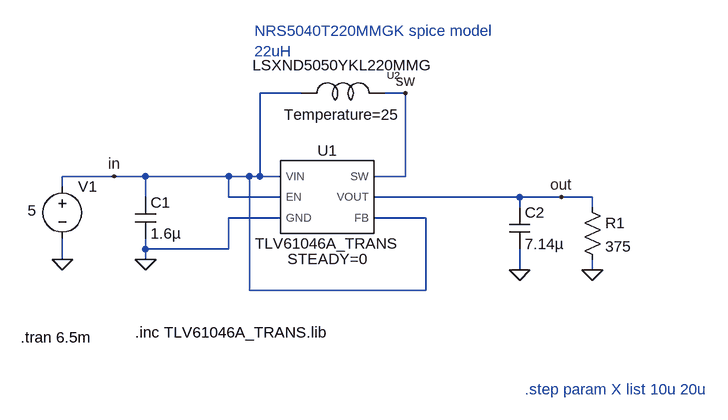
[diagram p0: schematic boost_TLV61046A.asc]
boost_TLV61046A.asc, the LTspice schematic file:
Version 4
SHEET 1 1272 680
WIRE 304 96 240 96
WIRE 464 96 432 96
WIRE 16 224 -64 224
WIRE 64 224 16 224
WIRE 192 224 64 224
WIRE 224 224 192 224
WIRE 240 224 240 96
WIRE 240 224 224 224
WIRE 272 224 240 224
WIRE 464 224 464 96
WIRE 464 224 416 224
WIRE -64 240 -64 224
WIRE 64 256 64 224
WIRE 192 256 192 224
WIRE 272 256 192 256
WIRE 640 256 416 256
WIRE 704 256 640 256
WIRE 752 256 704 256
WIRE 640 272 640 256
WIRE 752 272 752 256
WIRE 272 288 192 288
WIRE 496 288 416 288
WIRE 64 336 64 320
WIRE 192 336 192 288
WIRE 192 336 64 336
WIRE -64 352 -64 320
WIRE 64 352 64 336
WIRE 640 368 640 336
WIRE 752 368 752 352
WIRE 224 400 224 224
WIRE 496 400 496 288
WIRE 496 400 224 400
FLAG 640 368 0
FLAG 64 352 0
FLAG 752 368 0
FLAG -64 352 0
FLAG 704 256 out
FLAG 16 224 in
FLAG 464 96 sw
SYMBOL Cap 48 256 R0
SYMATTR InstName C1
SYMATTR Value 1.6µ
SYMBOL Cap 624 272 R0
SYMATTR InstName C2
SYMATTR Value 7.14µ
SYMBOL Res 736 256 R0
SYMATTR InstName R1
SYMATTR Value 375
SYMBOL Voltage -64 224 R0
WINDOW 3 -53 53 Left 2
SYMATTR Value 5
SYMATTR InstName V1
SYMATTR SpiceLine Rser=1m
SYMBOL LSXND5050YKL220MMG 368 96 R0
WINDOW 38 0 -43 Center 2
SYMATTR InstName U2
SYMBOL TLV61046A_TRANS 336 256 R0
SYMATTR InstName U1
TEXT -128 472 Left 2 !.tran 6.5m
TEXT 648 552 Left 2 ;.step param X list 10u 20u
TEXT 48 464 Left 2 !.inc TLV61046A_TRANS.lib
TEXT 232 0 Left 2 ;NRS5040T220MMGK spice model\n22uH

The netlist it stands for:
* boost_TLV61046A.asc
C1 in 0 1.6µ
C2 out 0 7.14µ
R1 out 0 375
V1 in 0 5 Rser=1m
XU2 in sw LSXND5050YKL220MMG Temperature=25  ; pins 1 2
XU1 in in 0 in out sw TLV61046A_TRANS STEADY=0  ; pins VIN EN GND FB VOUT SW
.tran 6.5m
* .step param X list 10u 20u
.inc TLV61046A_TRANS.lib
* NRS5040T220MMGK spice model
* 22uH
.lib LSXND5050YKL220MMG_LT.cir
.lib TLV61046A_TRANS.lib
.backanno
.end